# EAGLE schematic Схема ИБП (EAGLE 6.5.0)
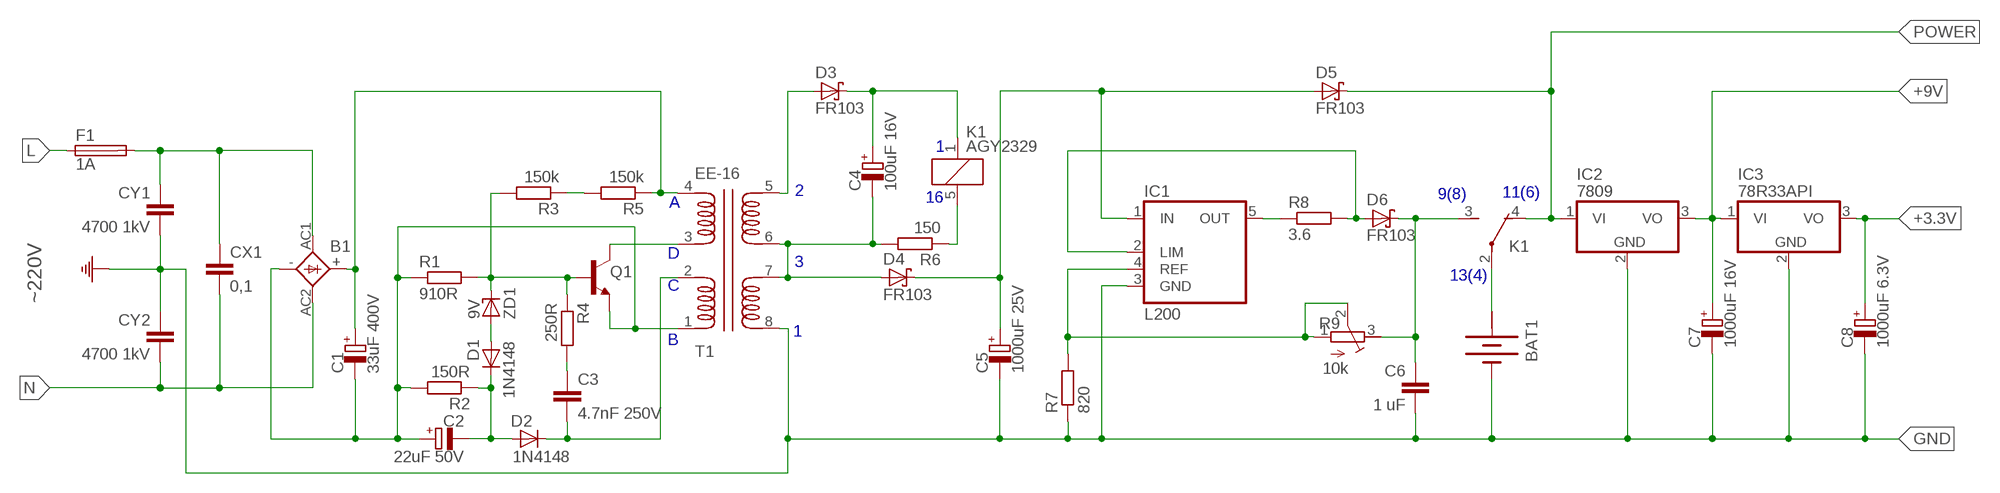
[diagram p0: schematic, sheet 1]

## Parts
B1  1KAB  [1KAB]
BAT1  BATTERY  [BATTERY]
C1  33uF 400V  CPOL-EU085CS-1AR  [085CS_1AR]
C2  22uF 50V  CPOL-EU085CS-1AR  [085CS_1AR]
C3  4.7nF 250V  C-EU025-024X044  [C025-024X044]
C4  100uF 16V  CPOL-EU085CS-1AR  [085CS_1AR]
C5  1000uF 25V  CPOL-EU085CS-1AR  [085CS_1AR]
C6  1 uF  C-EU025-024X044  [C025-024X044]
C7  1000uF 16V  CPOL-EU085CS-1AR  [085CS_1AR]
C8  1000uF 6.3V  CPOL-EU085CS-1AR  [085CS_1AR]
CX1  0,1  C-EU025-024X044  [C025-024X044]
CY1  4700 1kV  C-EU025-024X044  [C025-024X044]
CY2  4700 1kV  C-EU025-024X044  [C025-024X044]
D1  1N4148  1N4004  [DO41-10]
D2  1N4148  1N4004  [DO41-10]
D3  FR103  BAS40  [SOT23]
D4  FR103  BAS40  [SOT23]
D5  FR103  BAS40  [SOT23]
D6  FR103  BAS40  [SOT23]
F1  1А  GSH15  [GSH15]
IC1  L200  [L200S]
IC2  7809  7808T  [TO220H]
IC3  78R33API  7808T  [TO220H]
K1  AGY2329  G5SB  [G5SB]
Q1  2N706  [TO18]
R1  910R  R-EU_0204/2V  [0204V]
R2  150R  R-EU_0204/2V  [0204V]
R3  150k  R-EU_0204/2V  [0204V]
R4  250R  R-EU_0204/2V  [0204V]
R5  150k  R-EU_0204/2V  [0204V]
R6  150  R-EU_0204/2V  [0204V]
R7  820  R-EU_0204/2V  [0204V]
R8  3.6  R-EU_0204/2V  [0204V]
R9  10k  R-TRIMM4G/J  [RTRIM4G/J]
T1  EE-16  HDS28G2  [HDS28G2]
ZD1  9V  1N5333  [C1702-15]

## Nets
+3.3V: C8.+ IC3.3(VO)
+9V: C7.+ IC2.3(VO) IC3.1(VI)
GND: BAT1.- C5.- C6.2 C7.- C8.- CY1.2 CY2.1 IC1.3(GND) IC2.2(GND) IC3.2(GND) R7.1 T1.8(S1.1) ; supply symbol labelled 
L: F1.1
N: B1.AC2 CX1.2 CY2.2
N$1: Q1.2(B) R1.2 R3.2 R4.1 ZD1.C
N$2: BAT1.+ K1.2(U:P)
N$3: C4.- D4.1(A) R6.2 T1.6(S2.1) T1.7(S1.2)
N$5: K1.5 R6.1
N$6: Q1.3(C) T1.3(P2.1)
N$7: B1.- C1.- C2.+ Q1.1(E) R1.1 R2.2 T1.1(P1.1)
N$8: R3.1 R5.2
N$9: C3.2 D2.C T1.2(P1.2)
N$10: C3.1 R4.2
N$11: D1.A ZD1.A
N$12: C6.1 D6.3(C) K1.3(U:S) R9.3(A)
N$13: C2.- D1.C D2.A R2.1
N$15: D3.1(A) T1.5(S2.2)
N$16: C5.+ D4.3(C) D5.1(A) IC1.1(IN)
N$17: IC1.5(OUT) R8.1
N$18: D6.1(A) IC1.2(LIM) R8.2
N$19: B1.+ C1.+ R5.1 T1.4(P2.2)
N$20: C4.+ D3.3(C) K1.1
N$22: IC1.4(REF) R7.2 R9.1(E) R9.2(S)
N$23: B1.AC1 CX1.1 CY1.1 F1.2
POWER: D5.3(C) IC2.1(VI) K1.4(U:O)

## Notes on the sheet
- 1
- 2 | 9(8) | 11(6)
- 16
- A
- D
- 3
- 13(4)
- C
- ~220V
- 1
- B

## Power pins joined to a net without a drawn wire
+: BAT1.+@1(+)

## Library data of the parts
B1 = rectifier:1KAB: RECTIFIER grid 5,08 x 5,08 mm
BAT1 = special:BATTERY: BATTERY
C1 C2 C4 C5 C7 C8 = resistor:CPOL-EU: POLARIZED CAPACITOR, European symbol
C3 C6 CX1 CY1 CY2 = resistor:C-EU: CAPACITOR, European symbol
D1 D2 = diode:1N4004: DIODE general purpose rectifier, 1 A
D3-D6 = diode:BAS40: Silicon Schottky Diodes General-purpose diode for high-speed switching
F1 = fuse:GSH15: FUSE HOLDER grid 15mm, 19649 Wickmann; MPN: 64900001039; OC_FARNELL: 1271673; OC_NEWARK: 02P0318
IC1 = v-reg:L200: VOLTAGE REGULATOR
IC2 IC3 = linear:78*: Positive VOLTAGE REGULATOR Source: http://cache.national.com/ds/LM/LM78L05.pdf http://www.fairchildsemi.com/ds/LM/LM7805.pdf
K1 = relay:G5SB: Compact Single-pole Relay for Switching 5 A Source: http://www.omron.com/ecb/products/pry/121/g5sb.html; OC_FARNELL: unknown; OC_NEWARK: unknown
Q1 = transistor:2N706: NPN TRANSISTOR
R1-R8 = resistor:R-EU_: RESISTOR, European symbol
R9 = resistor:R-TRIMM: Trimm resistor
T1 = trafo-bei:HDS: Transformer Dual primary 115/230V 50/60HZ 10.0VA Source: BEI_DDS30F_10VA_size.pdf; OC_FARNELL: unknown; OC_NEWARK: unknown
ZD1 = diode:1N5333: Z DIODE 3.3 V, 5W, 5 percent (Motorola)